# Altium schematic sheet Sheet1.SchDoc
size A
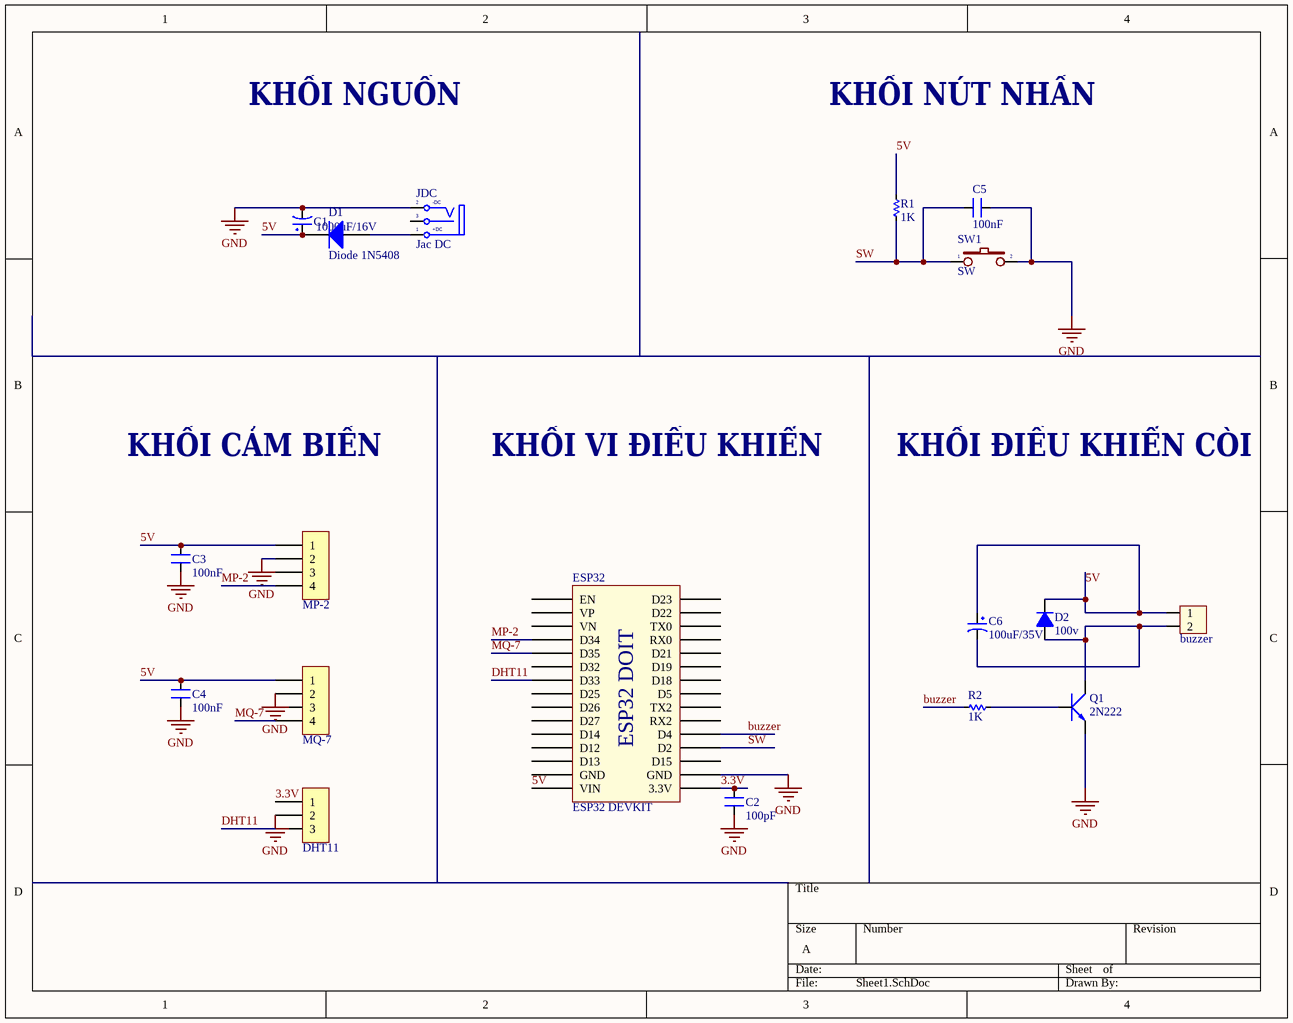
[diagram p0: Sheet1.SchDoc]

## Parts
buzzer  buzzer  [XH2.54M-2]
C1  1000uF/16V  [CP1.5/3.4]
C2  100pF  [CN1]
C3  100nF  [CN1]
C4  100nF  [CN1]
C5  100nF  [CN1]
C6  100uF/35V  [CP1.5/3.4]
D1  Diode 1N5408  [DO-201AD]
D2  100v  [DIODE 0.5A]
DHT11  DHT11  [XH2.54M-3]
ESP32  ESP32 DEVKIT  [ESP32 WROOM 32 KIT]
JDC  Jac DC  [DC-IN]
MP-2  MP-2  [XH2.54M-4]
MQ-7  MQ-7  [XH2.54M-4]
Q1  2N222  [TO92-123]
R1  1K  [RES-1/2W]
R2  1K  [RES-1/2W]
SW1  SW  [SW2]

## Nets
GND: C1.2 C2.1 C3.1 C4.2 C5.1 DHT11.2 ESP32.17(GND) JDC.2(TN) MP-2.2 MQ-7.2 Q1.1(E) SW1.2
3.3V: C2.2 DHT11.1 ESP32.16(3.3V)
5V: buzzer.1 C1.1 C3.2 C4.1 C6.1 D1.2(K) D2.2(K) ESP32.15(VIN) MP-2.1 MQ-7.1 R1.1
buzzer: ESP32.20(D4) R2.1
DHT11: DHT11.3 ESP32.7(D33)
MP-2: ESP32.4(D34) MP-2.4
MQ-7: ESP32.5(D35) MQ-7.4
SW: C5.2 ESP32.19(D2) R1.2 SW1.1
Netbuzzer_2: buzzer.2 C6.2 D2.1(A) Q1.3(C)
NetD1_1: D1.1(A) JDC.1(T)
NetQ1_2: Q1.2(B) R2.2

Not connected (* = marked no-connect by the designer): ESP32 1(EN) 2(VP) 3(VN) 6(D32) 8(D25) 9(D26) 10(D27) 11(D14) 12(D12) 13(D13) 14(GND) 18(D15) 21(RX2) 22(TX2) 23(D5) 24(D18) 25(D19) 26(D21) 27(RX0) 28(TX0) 29(D22) 30(D23); JDC 3(S); MP-2 3; MQ-7 3

## Notes on the sheet
- KHỐI NGUỒN
- KHỐI NÚT NHẤN
- KHỐI CẢM BIẾN
- KHỐI VI ĐIỀU KHIỂN
- KHỐI ĐIỀU KHIỂN CÒI
- (in symbol DCIN) -DC; +DC
- (in symbol ESP32 WROOM 32 KIT) ESP32 DOIT

## Library data of the parts
buzzer = Header 2P 2.54 Duc Thang: Cắm; Ten_Linh_Kien: Header 2P XH2.54-2P Đực Thẳng; Don_Vi: Con; Ma_Hang: MH001283; Chung_Loai: Cắm
C1 = CP4: Cap 1000uF/16V - 220uF/50V; Description 5: 4,7uF>10uF/250V_3,3uF>10uF/400V - 2,2uF>4,7uF/450V; Description 1: 2200uF-3300uF/6,3V - 1000uF-2200uF/10V; Description 2: 1000uF/16V - 470uF => 1000uF/25V - 100uF/100V; Description 3: 330uF>470uF/35V_220uF>470uF/50V_10uF>22uF/250V; Description 4: 220uF => 330uF/63V - 10uF =>33uF/160 - 200V; Value: 1000uF/16V
C2 = CN1: Cap np  1pF - 472pF; Value: 100pF
C3-C5 = CN1: Cap np  1pF - 472pF; Value: 100pF
C6 = CP3: Cap 100uF/35V - 470uF/16V; Value: 100uF/35V/50V; Description 1: 1000uF/6,3V - 470uF/16V - 330uF - 25V; Description 2: 220uF/35V - 100uF/50V - 63V - 4,7uF/200V; Description 3: 22uF => 33uF100V - 3,3uF => 4,7uF/250V; Description 4: 2,2uF =>3,3uF/350 - 2,2uF/400V - 1uF/450V
D1 = Diode 1N5408: 3 Amp Medium Power Silicon Rectifier Diode; Published: 8-Jun-2000; LatestRevisionDate: 17-Jul-2002; LatestRevisionNote: Re-released for DXP Platform.; DatasheetVersion: Aug-1984; PackageReference: DO-201AD; Publisher: Altium Limited; PackageDescription: Diode, Axial; Body 9.5 x 5.3 mm (LxDia. max), Lead Dia. 1.32 mm (max); ComponentLink1Description: Manufacturer Link; ComponentLink1URL: http://www.irf.com/
D2 = Diode 1N4148: Cắm; Ten_Linh_Kien: Diode 1N4148 DO35 450mA 100V ( 1N4148 DIP); Don_Vi: Con; Ma_Hang: MH001065; Ghi Chu: *; Kieu_Chan: *; Chung_Loai: Cắm
DHT11 = Header 3P 2.54 Duc Thang: Cắm; Ten_Linh_Kien: Header 3P XH2.54-3P Đực Thẳng; Don_Vi: Con; Ma_Hang: MH001292; Chung_Loai: Cắm
ESP32 = ESP32 WROOM 32 KIT
JDC = DCIN: Jac DC input; Value: Jac DC
MP-2 MQ-7 = Header 4P 2.54 Duc Thang: Cắm; Ten_Linh_Kien: Header 4P XH2.54-4P Đực Thẳng; Don_Vi: Con; Ma_Hang: MH001285; Chung_Loai: Cắm
Q1 = 2N222: NPN 600mW, ECB; Value: C1815
R1 R2 = Res: Manufacturer: Generic Components; Class: Passive; SubClass: R; Published: 08/06/2000; Publisher: Altium Hobart Technology Centre
SW1 = SW2: Switch button 2 pin; Value: SW chip 2 pin